# EAGLE design Decoder Servo v2 (EAGLE 9.6.2)
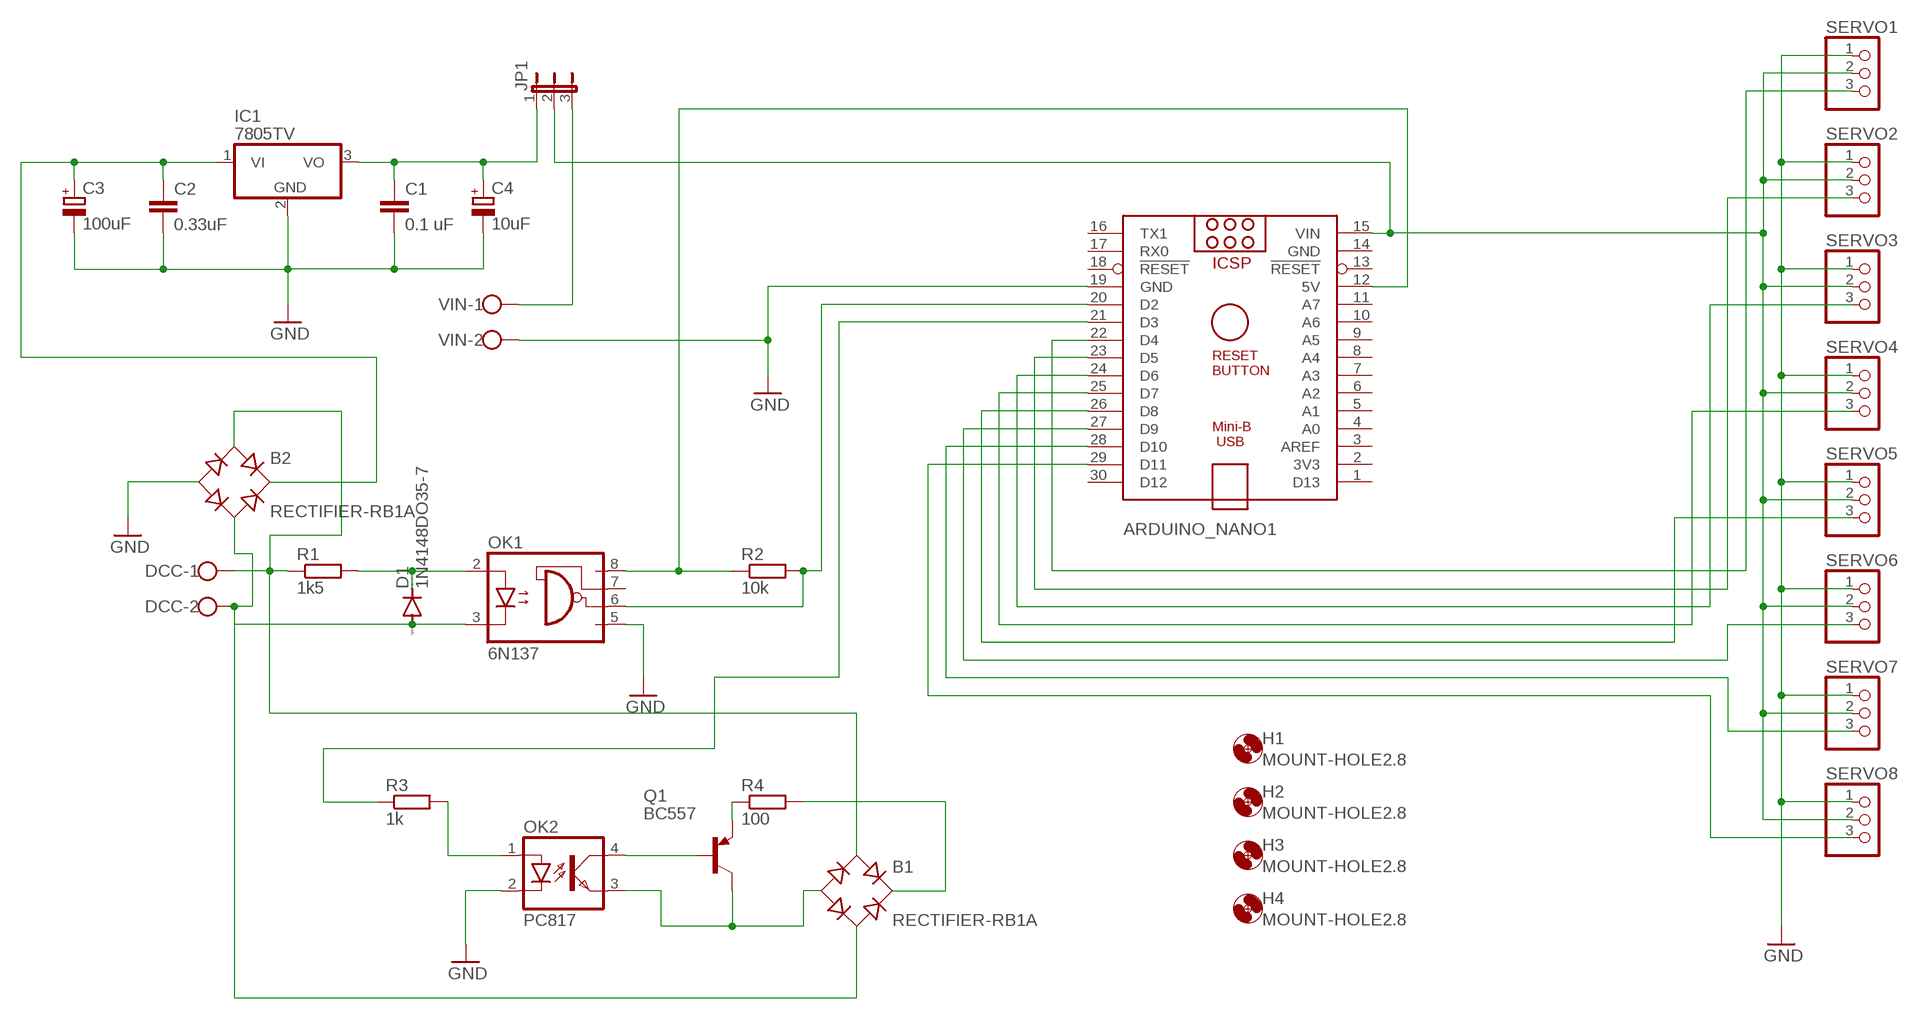
[diagram p0: schematic, sheet 1]

## Parts
ARDUINO_NANO1  ARDUINO_NANO  [ARDUINO_NANO]
B1  RECTIFIER-RB1A  [RB1A]
B2  RECTIFIER-RB1A  [RB1A]
C1  0.1 uF  C-EU025-024X044  [C025-024X044]
C2  0.33uF  C-EU025-024X044  [C025-024X044]
C3  100uF  CPOL-EUTAP5-50  [TAP5-50]
C4  10uF  CPOL-EUTAP5-50  [TAP5-50]
D1  1N4148DO35-7  [DO35-7]
DCC  W237-102  [W237-102]
H1  MOUNT-HOLE2.8  [2,8]
H2  MOUNT-HOLE2.8  [2,8]
H3  MOUNT-HOLE2.8  [2,8]
H4  MOUNT-HOLE2.8  [2,8]
IC1  7805TV  [TO220V]
JP1  JP2E  [JP2]
OK1  6N137  [DIL08]
OK2  PC817  [DIL04]
Q1  BC557  [TO92]
R1  1k5  R-EU_0207/10  [0207/10]
R2  10k  R-EU_0207/10  [0207/10]
R3  1k  R-EU_0207/10  [0207/10]
R4  100  R-EU_0207/10  [0207/10]
SERVO1  PINHD-1X3  [1X03]
SERVO2  PINHD-1X3  [1X03]
SERVO3  PINHD-1X3  [1X03]
SERVO4  PINHD-1X3  [1X03]
SERVO5  PINHD-1X3  [1X03]
SERVO6  PINHD-1X3  [1X03]
SERVO7  PINHD-1X3  [1X03]
SERVO8  PINHD-1X3  [1X03]
VIN  W237-102  [W237-102]

## Nets
GND [GND]: ARDUINO_NANO1.19(GND) B2.- C1.2 C2.2 C3.- C4.- IC1.2(GND) OK1.5(GND) OK2.2(C) SERVO1.1 SERVO2.1 SERVO3.1 SERVO4.1 SERVO5.1 SERVO6.1 SERVO7.1 SERVO8.1 VIN.2
N$1: D1.C OK1.2(A) R1.2
N$2 [DCC]: B1.AC2 B2.AC2 D1.A DCC.2 OK1.3(C)
N$3: ARDUINO_NANO1.12(5V) OK1.8(VCC) R2.1
N$4: ARDUINO_NANO1.20(D2) OK1.6(VO) R2.2
N$5 [DCC]: B1.AC1 B2.AC1 DCC.1 R1.1
N$6: OK2.4(COL) Q1.2(B)
N$7: ARDUINO_NANO1.21(D3) R3.1
N$8: OK2.1(A) R3.2
N$9: B1.- OK2.3(EMIT) Q1.3(C)
N$10: Q1.1(E) R4.1
N$11: B1.+ R4.2
N$13 [ServoSignals]: ARDUINO_NANO1.22(D4) SERVO1.3
N$14 [Vin]: B2.+ C2.1 C3.+ IC1.1(VI)
N$15 [Vin]: ARDUINO_NANO1.15(VIN) JP1.2 SERVO1.2 SERVO2.2 SERVO3.2 SERVO4.2 SERVO5.2 SERVO6.2 SERVO7.2 SERVO8.2
N$16 [ServoSignals]: ARDUINO_NANO1.23(D5) SERVO2.3
N$17 [ServoSignals]: ARDUINO_NANO1.24(D6) SERVO3.3
N$18 [ServoSignals]: ARDUINO_NANO1.25(D7) SERVO4.3
N$19 [ServoSignals]: ARDUINO_NANO1.26(D8) SERVO5.3
N$20 [ServoSignals]: ARDUINO_NANO1.27(D9) SERVO6.3
N$21 [ServoSignals]: ARDUINO_NANO1.28(D10) SERVO7.3
N$22 [ServoSignals]: ARDUINO_NANO1.29(D11) SERVO8.3
N$46 [Vin]: C1.1 C4.+ IC1.3(VO) JP1.1
N$47 [Vin]: JP1.3 VIN.1
Unconnected: ARDUINO_NANO1.1(D13) ARDUINO_NANO1.2(3V3) ARDUINO_NANO1.3(AREF) ARDUINO_NANO1.4(A0) ARDUINO_NANO1.5(A1) ARDUINO_NANO1.6(A2) ARDUINO_NANO1.7(A3) ARDUINO_NANO1.8(A4) ARDUINO_NANO1.9(A5) ARDUINO_NANO1.10(A6) ARDUINO_NANO1.11(A7) ARDUINO_NANO1.13(!RESET) ARDUINO_NANO1.16(TX1) ARDUINO_NANO1.17(RX0) ARDUINO_NANO1.18(!RESET) ARDUINO_NANO1.30(D12) OK1.7(VE)

## Power pins joined to a net without a drawn wire
GND: ARDUINO_NANO1.14(GND)

## Library data of the parts
ARDUINO_NANO1 = ArduinoNanoV30:ARDUINO_NANO: Arduino Nano V3.0 Overview: The Arduino Nano is a small, complete, and breadboard-friendly board based on the ATmega328 (Arduino Nano 3.x) or ATmega168 (Arduino Nano 2.x). It has more or less the same functionality of the Arduino Duemilanove, but in a different package. It lacks only a DC power jack, and works with a Mini-B USB cable instead of a standard one. The Nano was designed and is being produced by Gravitech. Specifications: Microcontroller Atmel ATmega168 or ATmega328 Operating Voltage (logic level) 5 V Input Voltage (recommended) 7-12 V Input Voltage (limits) 6-20 V Digital I/O Pins 14 (of which 6 provide PWM output) Analog Input Pins 8 DC Current per I/O Pin 40 mA Flash Memory 16 KB (ATmega168) or 32 KB (ATmega328) of which 2 KB used by bootloader SRAM 1 KB (ATmega168) or 2 KB (ATmega328) EEPROM 512 bytes (ATmega168) or 1 KB (ATmega328) Clock Speed 16 MHz Dimensions 0.73" x 1.70" Length 45 mm Width 18 mm Weigth 5 g Power: The Arduino Nano can be powered via the Mini-B USB connection, 6-20V unregulated external power supply (pin 30), or 5V regulated external power supply (pin 27). The power source is automatically selected to the highest voltage source. Memory: The ATmega168 has 16 KB of flash memory for storing code (of which 2 KB is used for the bootloader); the ATmega328 has 32 KB, (also with 2 KB used for the bootloader). The ATmega168 has 1 KB of SRAM and 512 bytes of EEPROM (which can be read and written with the EEPROM library); the ATmega328 has 2 KB of SRAM and 1 KB of EEPROM. Input and Output: Each of the 14 digital pins on the Nano can be used as an input or output, using pinMode(), digitalWrite(), and digitalRead() functions. They operate at 5 volts. Each pin can provide or receive a maximum of 40 mA and has an internal pull-up resistor (disconnected by default) of 20-50 kOhms. In addition, some pins have specialized functions. Visit Arduino - ArduinoBoardNano <https://www.arduino.cc/en/Main/ArduinoBoardNano>
B1 B2 = rectifier:RECTIFIER-: Rectifier
C1 C2 = rcl:C-EU: CAPACITOR, European symbol; SPICEPREFIX: C
C3 C4 = rcl:CPOL-EU: POLARIZED CAPACITOR, European symbol; SPICEPREFIX: C
D1 = diode:1N4148: DIODE high speed (Philips)
DCC VIN = con-wago-500:W237-102: WAGO SCREW CLAMP; MPN: 237-102; OC_FARNELL: unknown; OC_NEWARK: 70K9898
H1-H4 = holes:MOUNT-HOLE: MOUNTING HOLE with drill center marker
IC1 = linear:78*: Positive VOLTAGE REGULATOR Source: http://cache.national.com/ds/LM/LM78L05.pdf http://www.fairchildsemi.com/ds/LM/LM7805.pdf
JP1 = jumper:JP2E: JUMPER
OK1 = optocoupler:6N137: MOTOROLA OPTO COUPLER; MPN: 6N137; OC_FARNELL: 1328376; OC_NEWARK: 52M1895
OK2 = optocoupler:PC817: SHARP OPTO COUPLER; MPN: PC817X4J000F; OC_FARNELL: 9707727; OC_NEWARK: 97K7059
Q1 = transistor-pnp:BC557: PNP Transistor
R1-R4 = rcl:R-EU_: RESISTOR, European symbol; SPICEPREFIX: R
SERVO1-SERVO8 = adafruit:PINHD-1X3: PIN HEADER

## Net classes
0 default: width 0.254 mm, clearance 0.254 mm
1 POWER: width 0.635 mm, clearance 0.254 mm
2 DCC: width 0.508 mm, clearance 0.254 mm
3 Vin: width 0.762 mm, clearance 0.254 mm
4 Signals: width 0.381 mm, clearance 0.254 mm
5 GND: width 0.889 mm, clearance 0.254 mm
6 ServoSignals: width 0.508 mm, clearance 0.254 mm

## Board
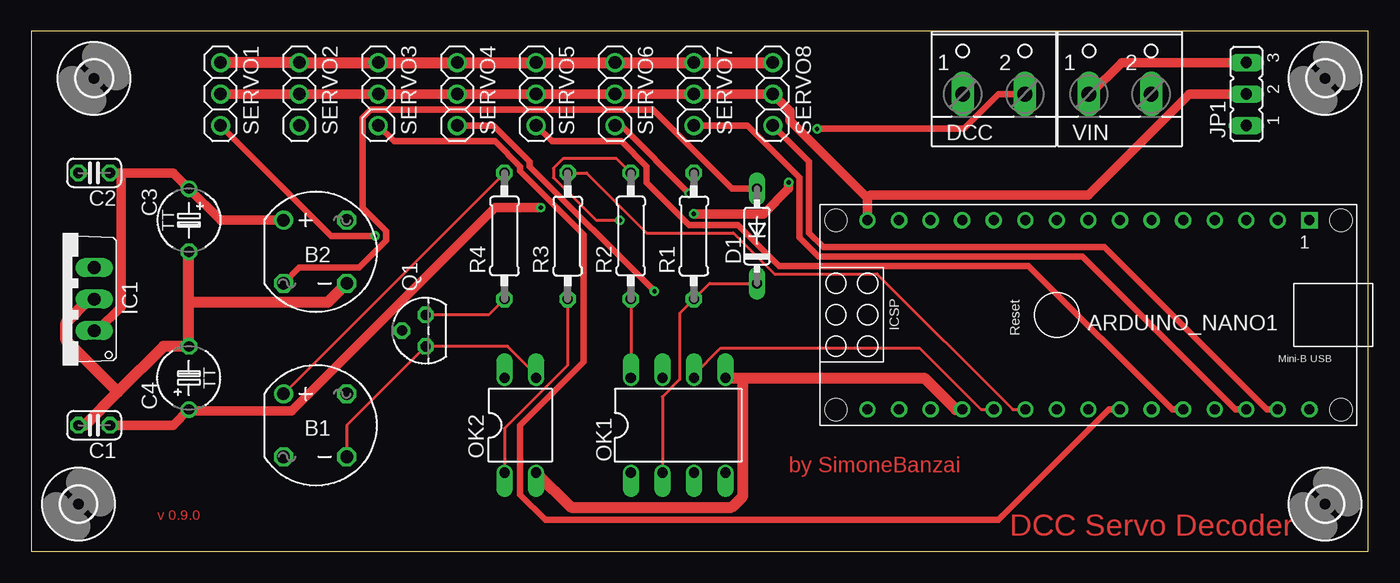
[diagram p1: board, top side]
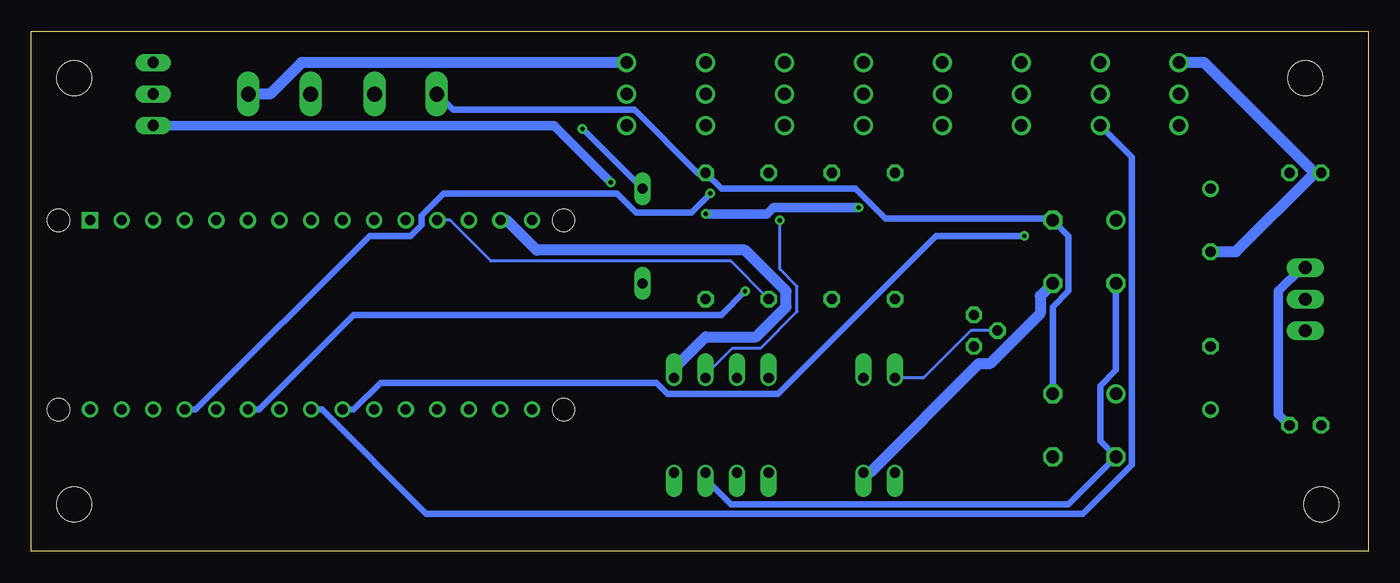
[diagram p2: board, bottom side, seen from below]

Size 107.62 x 41.9 mm. Coordinates in mm from the lower left corner, seen from the top.
Outline: 0,0 107.62,0 107.62,41.9 0,41.9 0,0
Copper layers (1*16): Top 0.035mm / dielectric 1.5mm / Bottom 0.035mm
Design rules "default": minimum track width 6mil, minimum drill 0.35mm, track to track 6mil, track to pad 6mil, pad to pad 6mil, via to via 6mil, smd to smd 6mil, copper to edge 40mil, drill to drill 6mil, minimum pad ring 10mil, minimum via ring 8mil, stop-mask expansion 4mil, vias tented up to drill 0mil, thermal gap 10mil

### Footprints (pad centres in the part's own frame; a part is rotated, then mirrored left to right if it is on the bottom)
ARDUINO_NANO = drill 0.8 square: 1 -20.32,-7.62 | drill 0.8: 2 -17.78,-7.62; 3 -15.24,-7.62; 4 -12.7,-7.62; 5 -10.16,-7.62; 6 -7.62,-7.62; 7 -5.08,-7.62; 8 -2.54,-7.62; 9 0,-7.62; 10 2.54,-7.62; 11 5.08,-7.62; 12 7.62,-7.62; 13 10.16,-7.62; 14 12.7,-7.62; 15 15.24,-7.62; 16 15.24,7.62; 17 12.7,7.62; 18 10.16,7.62; 19 7.62,7.62; 20 5.08,7.62; 21 2.54,7.62; 22 0,7.62; 23 -2.54,7.62; 24 -5.08,7.62; 25 -7.62,7.62; 26 -10.16,7.62; 27 -12.7,7.62; 28 -15.24,7.62; 29 -17.78,7.62; 30 -20.32,7.62 | hole 1.778: -22.86,-7.62; -22.86,7.62; 17.78,7.62; 17.78,-7.62
RB1A = drill 1.016: + -2.54,2.54 | drill 1.016 octagon: - 2.54,-2.54; AC1 2.54,2.54; AC2 -2.54,-2.54
C025-024X044 = drill 0.813 octagon: 1 -1.27,0; 2 1.27,0
TAP5-50 = drill 0.813: + -2.54,0 | drill 0.813 octagon: - 2.54,0
DO35-7 = drill 0.813 long: A 3.81,0; C -3.81,0
W237-102 = drill 1.194 long: 1 -2.5,-1.27; 2 2.5,-1.27
2,8 = hole 2.8: 0,0
TO220V = drill 1.016 long: 1 -2.54,-2.54; 2 0,-2.54; 3 2.54,-2.54
JP2 = drill 0.914 long: 1 -2.54,0; 2 0,0; 3 2.54,0
DIL08 = drill 0.813 offset: 1 -3.81,-3.81; 2 -1.27,-3.81; 3 1.27,-3.81; 4 3.81,-3.81; 5 3.81,3.81; 6 1.27,3.81; 7 -1.27,3.81; 8 -3.81,3.81
DIL04 = drill 0.813 offset: 1 -1.27,-3.81; 2 1.27,-3.81; 3 1.27,3.81; 4 -1.27,3.81
TO92 = drill 0.813 octagon: 1 1.27,0; 2 0,1.905; 3 -1.27,0
0207/10 = drill 0.813 octagon: 1 -5.08,0; 2 5.08,0
1X03 = drill 1.016: 1 -2.54,0; 2 0,0; 3 2.54,0

### Placement (x,y rotation side)
ARDUINO_NANO1  82.55,19.05 180 top
B1  22.86,10.16 0 top
B2  22.86,24.13 0 top
C1  5.08,10.16 180 top
C2  5.08,30.48 180 top
C3  12.7,26.67 270 top
C4  12.7,13.97 90 top
D1  58.42,25.4 90 top
DCC  77.47,38.1 0 top
H1  104.14,38.1 0 top
H2  5.08,38.1 0 top
H3  3.81,3.81 0 top
H4  104.14,3.81 0 top
IC1  2.54,20.32 90 top
JP1  97.79,36.83 90 top
OK1  52.07,10.16 0 top
OK2  39.37,10.16 0 top
Q1  31.75,17.78 90 top
R1  53.34,25.4 270 top
R2  48.26,25.4 90 top
R3  43.18,25.4 270 top
R4  38.1,25.4 90 top
SERVO1  15.24,36.83 270 top
SERVO2  21.59,36.83 270 top
SERVO3  27.94,36.83 270 top
SERVO4  34.29,36.83 270 top
SERVO5  40.64,36.83 270 top
SERVO6  46.99,36.83 270 top
SERVO7  53.34,36.83 270 top
SERVO8  59.69,36.83 270 top
VIN  87.63,38.1 0 top

### Tracks (layer width: path | path; a pad name or v marks a point on that pad's centre or on a via)
GND
  Top 0.889: SERVO1.1 SERVO2.1 SERVO3.1 SERVO4.1 SERVO5.1 SERVO6.1 SERVO7.1 SERVO8.1 | ARDUINO_NANO1.19 74.42,11.43 71.88,13.97 57.28,13.97 | OK1.5 57.28,13.97 | C1.2 4.32,10.16 6.99,12.83 | 6.99,12.83 10.67,16.51 C4.- 12.7,20.07 | 12.7,20.07 C3.- | IC1.2 4.7,20.32 2.79,18.41 2.79,17.02 6.99,12.83 | 12.7,20.07 23.88,20.07 B2.- | 57.28,13.97 57.28,4.45 56.39,3.56 43.43,3.56 OK2.2
  Bottom 0.889: VIN.2 88.39,36.83 85.85,39.37 SERVO8.1 | ARDUINO_NANO1.14 69.34,26.67 66.93,24.26 50.16,24.26 46.86,20.95 46.86,19.68 49.28,17.27 53.34,17.27 55.88,14.73 OK1.5 | 4.32,30.48 C2.2 | 4.32,30.48 10.67,24.13 C3.- | OK2.2 40.13,6.35 31.37,15.11 30.48,15.11 26.42,19.18 26.42,20.57 B2.- | SERVO1.1 13.21,39.37 4.32,30.48
N$1
  Top 0.254: OK1.2 50.8,12.45 52.2,13.84 52.2,19.18 R1.2 54.61,21.59 D1.C
N$2  (via drill 0.35)
  Top 0.508: DCC.2 77.85,36.83 75.06,34.04 v63.25,34.04 | D1.A 56.39,29.21 50.04,35.56 27.3,35.56 26.67,34.93 26.67,27.69 28.57,25.78 28.57,25.02 26.42,22.86 21.59,22.86 B2.AC2
  Bottom 0.508: D1.A v63.25,34.04 | OK1.3 53.34,5.84 51.31,3.81 24.13,3.81 B1.AC2 21.59,8.89 21.59,13.34 20.32,14.6 B2.AC2
N$3
  Top 0.254: R2.1 OK1.8
  Bottom 0.254: ARDUINO_NANO1.12 73.91,26.67 70.61,23.37 51.31,23.37 R2.1
N$4  (via drill 0.35)
  Top 0.254: v47.37,26.67 45.47,26.67 42.04,30.1 42.04,30.86 42.8,31.62 47.12,31.62 R2.2 | ARDUINO_NANO1.20 76.45,11.43 71.5,16.38 55.5,16.38 53.34,14.22 OK1.6
  Bottom 0.254: v47.37,26.67 47.37,22.73 45.97,21.34 45.97,19.3 48.9,16.38 51.18,16.38 53.34,14.22 OK1.6
N$5
  Bottom 0.508: B1.AC1 25.4,19.68 24.13,20.95 24.13,25.4 B2.AC1 25.53,26.8 38.86,26.8 41.27,29.21 52.07,29.21 R1.1 53.98,30.48 59.05,35.56 73.66,35.56 74.93,36.83 DCC.1
N$6
  Bottom 0.254: OK2.4 35.81,13.97 32,17.78 Q1.2
N$7
  Top 0.254: ARDUINO_NANO1.21 78.99,11.43 68.07,22.35 59.82,22.35 56.52,25.65 49.53,25.65 44.7,30.48 R3.1
N$8
  Top 0.254: OK2.1 38.1,9.91 43.18,14.99 R3.2
N$9
  Top 0.254: OK2.3 40.64,14.22 38.35,16.51 Q1.3 25.4,10.16 B1.-
N$10
  Top 0.254: Q1.1 36.83,19.05 R4.1
N$11
  Top 0.254: B1.+ R4.2
N$13  (via drill 0.35)
  Top 0.508: v27.69,25.4 24.13,25.4 SERVO1.3
  Bottom 0.508: ARDUINO_NANO1.22 81.66,11.43 79.5,13.59 57.28,13.59 56.39,12.7 47.5,12.7 34.8,25.4 v27.69,25.4
N$14
  Top 0.762: 7.24,30.48 11.43,30.48 C3.+ 15.24,26.67 B2.+ | 7.24,30.48 C2.1 | IC1.1 5.33,17.78 7.24,19.68 7.24,30.48
N$15
  Top 0.762: SERVO1.2 SERVO2.2 SERVO3.2 SERVO4.2 SERVO5.2 SERVO6.2 SERVO7.2 SERVO8.2 61.09,35.43 61.09,34.67 67.31,28.45 | 67.31,28.45 ARDUINO_NANO1.15 | JP1.2 93.22,36.83 85.09,28.7 67.56,28.7 67.31,28.45
N$16
  Bottom 0.508: ARDUINO_NANO1.23 84.2,11.43 75.82,3.05 22.99,3.05 19.05,6.98 19.05,31.75 SERVO2.3
N$17
  Top 0.508: ARDUINO_NANO1.24 86.74,11.43 77.85,2.54 41.4,2.54 39.37,4.57 39.37,10.16 44.45,15.24 44.45,25.53 39.37,30.61 39.37,30.99 37.34,33.02 29.21,33.02 SERVO3.3
N$18  (via drill 0.35)
  Top 0.508: v50.16,20.95 40.13,30.99 40.13,31.37 37.21,34.29 SERVO4.3
  Bottom 0.508: ARDUINO_NANO1.25 89.28,11.43 81.66,19.05 52.07,19.05 v50.16,20.95
N$19
  Top 0.508: ARDUINO_NANO1.26 91.82,11.43 80.26,22.99 60.2,22.99 56.9,26.29 52.96,26.29 49.53,29.72 49.53,30.99 47.5,33.02 41.91,33.02 SERVO5.3
N$20  (via drill 0.35)
  Top 0.508: v52.96,28.83 47.5,34.29 SERVO6.3
  Bottom 0.508: ARDUINO_NANO1.27 94.36,11.43 80.39,25.4 77.09,25.4 76.2,26.29 76.2,27.05 74.42,28.83 60.45,28.83 58.93,27.3 54.48,27.3 v52.96,28.83
N$21
  Top 0.508: ARDUINO_NANO1.28 96.9,11.43 84.58,23.75 63.37,23.75 61.85,25.27 61.85,30.1 57.66,34.29 SERVO7.3
N$22
  Top 0.508: ARDUINO_NANO1.29 99.44,11.43 86.36,24.51 63.75,24.51 62.61,25.65 62.61,31.37 SERVO8.3
N$46  (via drill 0.35)
  Top 0.762: C1.1 11.43,10.16 C4.+ 12.95,11.3 20.95,11.3 37.34,27.69 v41.02,27.69 | v60.96,29.72 60.96,29.21 58.93,27.18 v53.34,27.18
  Bottom 0.762: JP1.1 65.53,34.29 v60.96,29.72 | v53.34,27.18 48.39,27.18 47.88,27.69 v41.02,27.69 | IC1.3 5.33,22.86 7.24,20.95 7.24,11.05 C1.1
N$47
  Top 0.762: JP1.3 87.76,39.37 85.22,36.83 VIN.1

### Text on the board
Top: by SimoneBanzai | v 0.9.0 | DCC Servo Decoder